# Altium schematic sheet IOT_Masterv2_301115_Power.SchDoc
size A
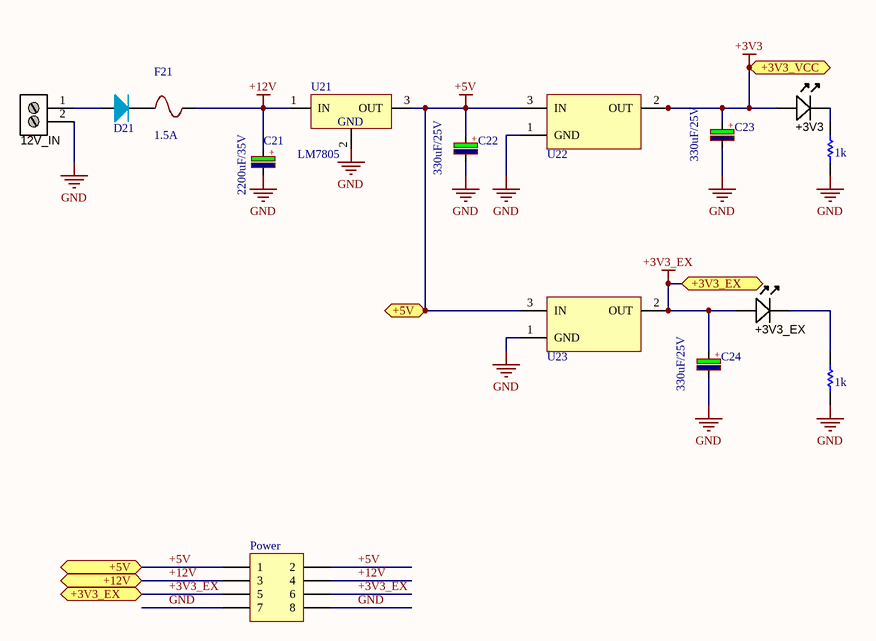
[diagram p0: IOT_Masterv2_301115_Power.SchDoc]

## Parts
12V_IN  Stackable ScrewTerm  [2P_PCB_ScrewTerm_200mil]  (value not drawn)
+3V3  Blue  [LED-0805-K]  (value not drawn)
+3V3_EX  Blue  [LED-0805-K]  (value not drawn)
C21  2200uF/35V  [CP_1000uF_25V]
C22  330uF/25V  [CP1.5/3.4]
C23  330uF/25V  [CP1.5/3.4]
C24  330uF/25V  [CP1.5/3.4]
D21  Diode  [DO-214AC]  (value not drawn)
F21  1.5A  [FUSE_SR-5-BK]
Power  Header 4X2  [HDR2X4]  (value not drawn)
R21  value 1k  [RESC2012N_F]  (hidden comment: Res_0805_1k)
R22  value 1k  [RESC2012N_F]  (hidden comment: Res_0805_1k)
U21  LM7805  [TO-220]
U22  AS1117  [SOT223-4N]  (value not drawn)
U23  AS1117  [SOT223-4N]  (value not drawn)

## Ports
+3V3_EX, +3V3_VCC, +5V, +12V

## Nets
+3V3: +3V3.A C23.1 U22.2(OUT) U22.4 ; port +3V3_VCC
+3V3_EX: +3V3_EX.A C24.1 Power.5 Power.6 U23.2(OUT) U23.4 ; port +3V3_EX
+5V: C22.1 Power.1 Power.2 U21.3(OUT) U22.3(IN) U23.3(IN) ; port +5V
+12V: C21.1 F21.2 Power.3 Power.4 U21.1(IN) ; port +12V
GND: 12V_IN.2 C21.2 C22.2 C23.2 C24.2 Power.7 Power.8 R21.2 R22.2 U21.2 U22.1(GND) U23.1(GND)
Net12V_IN_1: 12V_IN.1 D21.1(A)
Net+3V3_EX_K: +3V3_EX.K R22.1
Net+3V3_K: +3V3.K R21.1
NetD21_2: D21.2(K) F21.1

## Notes on the sheet
- (in symbol CP4) +
- (in symbol LM78xx) GND

## Library data of the parts
12V_IN = 2P_ScrewTerm_90S_3.81MM: Terminal Block Screw Type THT 2-Position 3.81mm pitch; Manufacturer 1: Tyco Electronics; Manufacturer Part Number 1: 1776113-2; Value: 2 position; Pitch: 0.150" (3.81mm); Positions Per Level: 2; Package / Case: Side Entry; 3.81mm pitch; Category: Connectors Interconnects; Color: Black; Supplier 1: Digi-Key; Supplier Part Number 1: A97976-ND
+3V3 +3V3_EX = LED_SMD_Blue_0805_100mcd: LED 0805 SMD Blue 100mcd 470nm; Manufacturer 1: Ligitek; Manufacturer Part Number 1: LG-170DBKZ-CT; Ratings: 100 mcd; 470 nm; Package / Case: 0805; Material: InGaN/GaN; Value: Blue; Color: Blue
C21-C24 = CP4: Cap 1000uF/16V - 220uF/50V; Description 5: 4,7uF>10uF/250V_3,3uF>10uF/400V - 2,2uF>4,7uF/450V; Description 1: 2200uF-3300uF/6,3V - 1000uF-2200uF/10V; Description 2: 1000uF/16V - 470uF => 1000uF/25V - 100uF/100V; Description 3: 330uF>470uF/35V_220uF>470uF/50V_10uF>22uF/250V; Description 4: 220uF => 330uF/63V - 10uF =>33uF/160 - 200V; Value: 1000uF/16V
D21 = Diode: pin to pad: 1>A 2>K
F21 = Fuse
Power = Header 4X2: Header, 4-Pin, Dual row; LatestRevisionDate: 17-Jul-2002; LatestRevisionNote: Re-released for DXP Platform.; Publisher: Altium Limited
R21 R22 = Res
U21 = LM78xx